# Altium schematic sheet 12-UART_CAN.SchDoc
size C
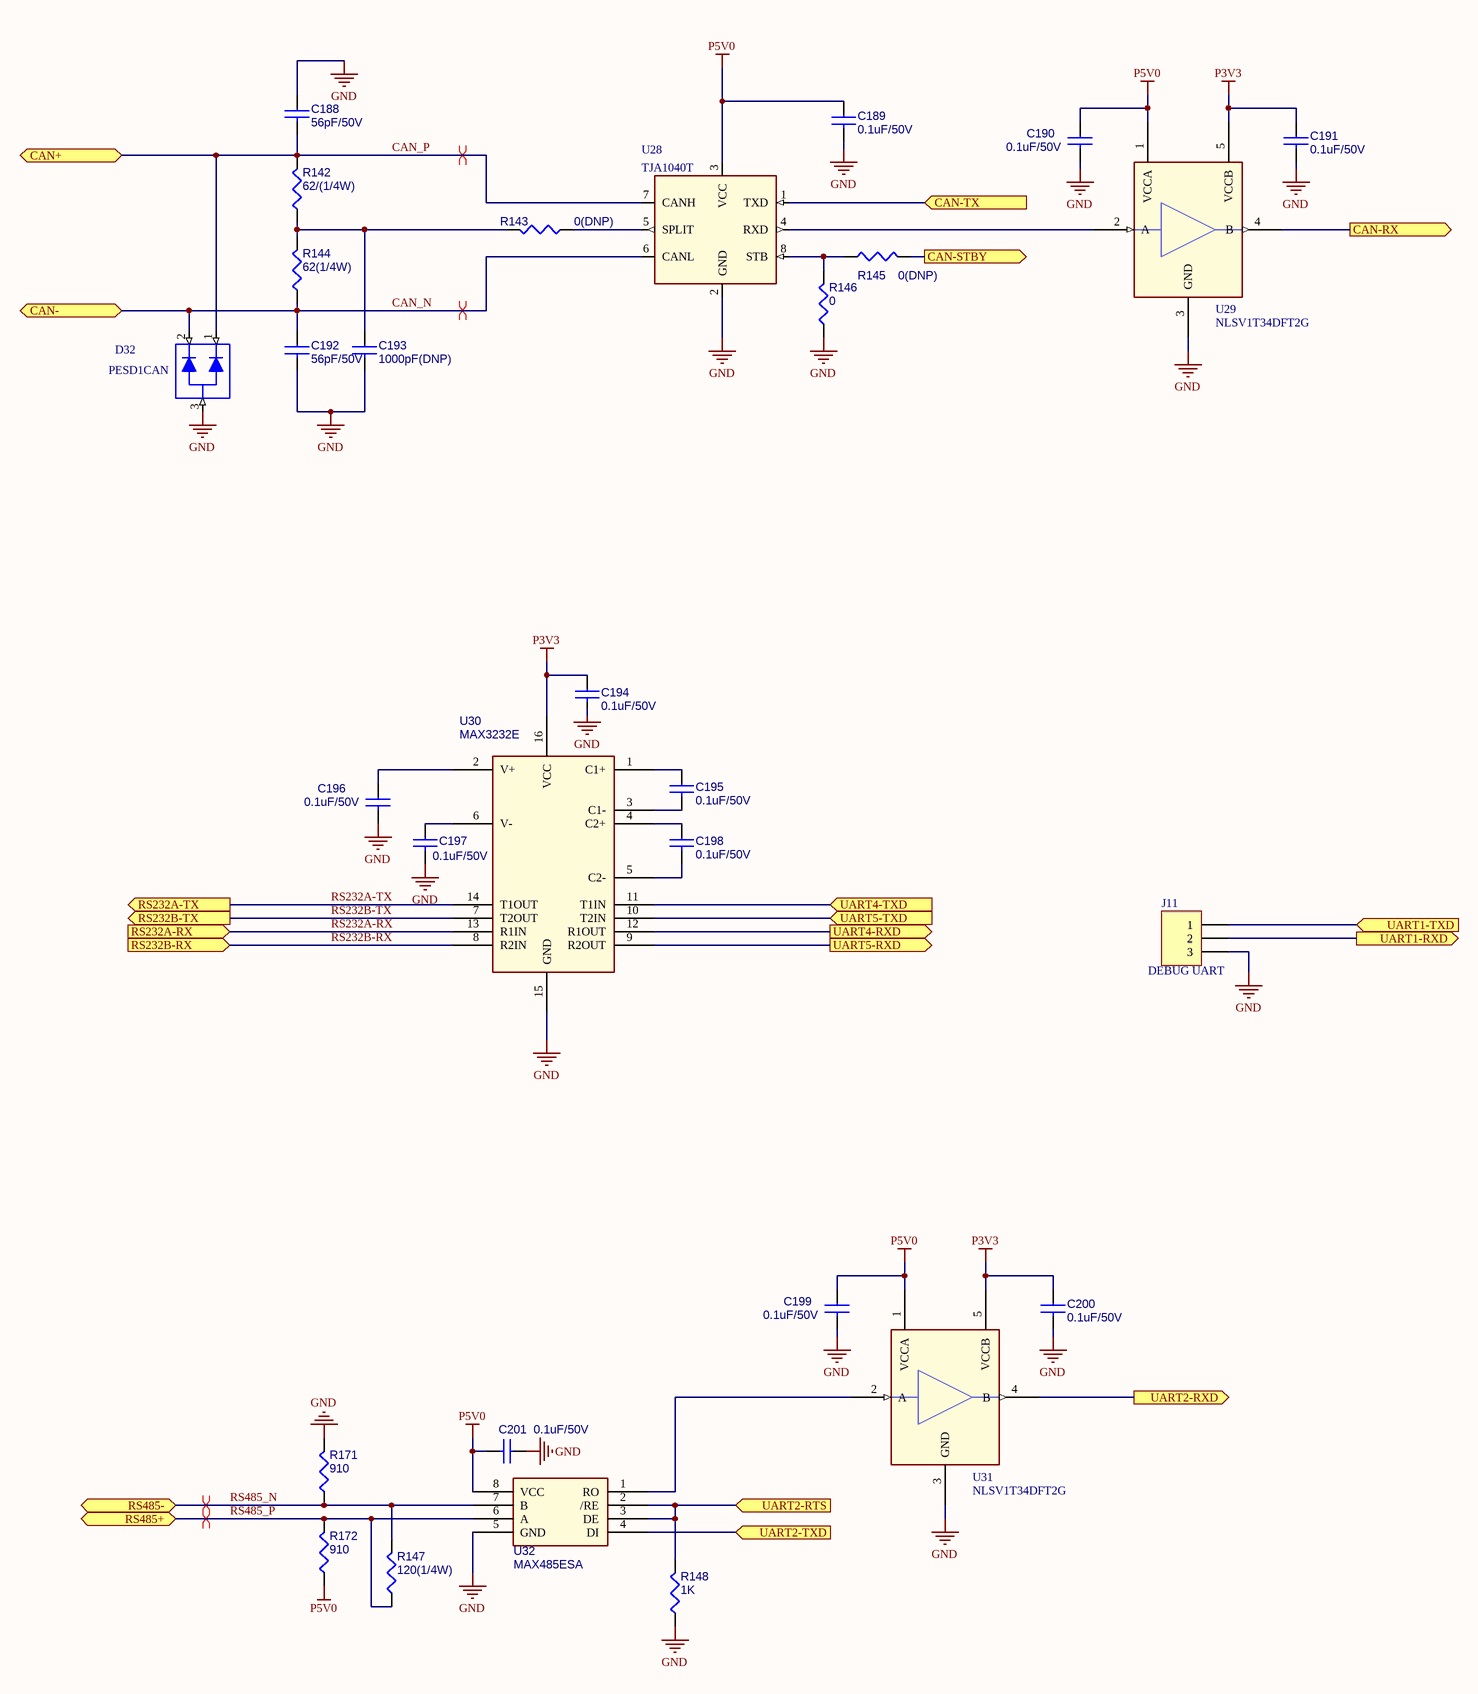
[diagram p0: 12-UART_CAN.SchDoc]

## Parts
C188  56pF/50V  [0402]
C189  0.1uF/50V  [0402]
C190  0.1uF/50V  [0402]
C191  0.1uF/50V  [0402]
C192  56pF/50V  [0402]
C193  1000pF(DNP)  [0402]
C194  0.1uF/50V  [0402]
C195  0.1uF/50V  [0402]
C196  0.1uF/50V  [0402]
C197  0.1uF/50V  [0402]
C198  0.1uF/50V  [0402]
C199  0.1uF/50V  [0402]
C200  0.1uF/50V  [0402]
C201  0.1uF/50V  [0402]
D32  PESD1CAN  [PESD2CAN]
J11  DEBUG UART  [HDR1X3]
R142  62/(1/4W)  [1206]
R143  0(DNP)  [0402]
R144  62(1/4W)  [1206]
R145  0(DNP)  [0402]
R146  0  [0402]
R147  120(1/4W)  [1206]
R148  1K  [0402]
R171  910  [0402]
R172  910  [0402]
U28  TJA1040T  [SO8]
U29  NLSV1T34DFT2G  [SC70]
U30  MAX3232E  [SO-16]
U31  NLSV1T34DFT2G  [SC70]
U32  MAX485ESA  [SO8]

## Ports
CAN+ (bidir), CAN- (bidir), CAN-RX (out), CAN-STBY (out), CAN-TX (in), RS232A-RX (in), RS232A-TX (out), RS232B-RX (in), RS232B-TX (out), RS485+ (bidir), RS485- (bidir), UART1-RXD (out), UART1-TXD (in), UART2-RTS (in), UART2-RXD (out), UART2-TXD (in), UART4-RXD (out), UART4-TXD (in), UART5-RXD (out), UART5-TXD (in)

## Nets
GND: C188.1 C189.2 C190.2 C191.2 C192.2 C193.2 C194.2 C196.2 C197.2 C199.2 C200.2 C201.1 D32.3 J11.3 R146.2 R148.2 R171.1 U28.2(GND) U29.3(GND) U30.15(GND) U31.3(GND) U32.5(GND)
P3V3: C191.1 C194.1 C200.1 U29.5(VCCB) U30.16(VCC) U31.5(VCCB)
P5V0: C189.1 C190.1 C199.1 C201.2 R172.2 U28.3(VCC) U29.1(VCCA) U31.1(VCCA) U32.8(VCC)
CAN-RX: U29.4(B) ; port CAN-RX
CAN-STBY: R145.1 ; port CAN-STBY
CAN-TX: U28.1(TXD) ; port CAN-TX
CAN_N: C192.1 D32.2 R144.2 U28.6(CANL) ; port CAN-
CAN_P: C188.2 D32.1 R142.1 U28.7(CANH) ; port CAN+
RS232A-RX: U30.13(R1IN) ; port RS232A-RX
RS232A-TX: U30.14(T1OUT) ; port RS232A-TX
RS232B-RX: U30.8(R2IN) ; port RS232B-RX
RS232B-TX: U30.7(T2OUT) ; port RS232B-TX
RS485_N: R147.1 R171.2 U32.7(B) ; port RS485-
RS485_P: R147.2 R172.1 U32.6(A) ; port RS485+
UART1-RXD: J11.2 ; port UART1-RXD
UART1-TXD: J11.1 ; port UART1-TXD
UART2-RTS: R148.1 U32.2(/RE) U32.3(DE) ; port UART2-RTS
UART2-RXD: U31.4(B) ; port UART2-RXD
UART2-TXD: U32.4(DI) ; port UART2-TXD
UART4-RXD: U30.12(R1OUT) ; port UART4-RXD
UART4-TXD: U30.11(T1IN) ; port UART4-TXD
UART5-RXD: U30.9(R2OUT) ; port UART5-RXD
UART5-TXD: U30.10(T2IN) ; port UART5-TXD
NetC193_1: C193.1 R142.2 R143.1 R144.1
NetC195_1: C195.1 U30.1(C1+)
NetC195_2: C195.2 U30.3(C1-)
NetC196_1: C196.1 U30.2(V+)
NetC197_1: C197.1 U30.6(V-)
NetC198_1: C198.1 U30.4(C2+)
NetC198_2: C198.2 U30.5(C2-)
NetR143_2: R143.2 U28.5(SPLIT)
NetR145_2: R145.2 R146.1 U28.8(STB)
NetU28_4: U28.4(RXD) U29.2(A)
NetU31_2: U31.2(A) U32.1(RO)

## Layout directives
differential pair: CAN_N, CAN_P, RS485_N, RS485_P

## Library data of the parts
C188-C193 C199 C200 = P_CAP NP
C194-C198 = CAP
C201 = P_CAP NP: Part Number: SE132225K8L; Part Description: S CER CAP 2.2U 10V K X5R 0603; Function Field: 41.5; Ecology: YES; ROOM: GPS; AP: AP; Part Type: CAPACITOR; Approved Date: 6/27/2006; Lead Free: MY
D32 = PESD2CAN: Part Number: SCA00000J00
J11 = Header 3: Header, 3-Pin; LatestRevisionDate: 17-Jul-2002; LatestRevisionNote: Re-released for DXP Platform.; Publisher: Altium Limited
R142-R146 = P_R
R147 R148 R171 R172 = R: Manufacturer Part number: null; Part Description: S RES 1/16W 10K +-5% 0402; Part Number: SD02810028L; ROOM: SD; Deletion Flag: 0; Function Field: 32.3; Ecology: YES; Part Type: RESISTOR; AP Sheet: http://ISPDPRD/Windchill/servlet/WindchillAuthGW/wt.enterprise.URLProcessor/URLTemplateAction?u8&oid=VR%3Aext.compal.part.Comp; AP: AP; Lead Free: Y1
U28 = TJA1040T_SO_8P: IC XCVR CAN HS 5V SO8; CAD_APPROVED: Yes; MFG_NAME01: NXP SEMICONDUCTORS; AGILE_PN: 312-79676; CLASS: IC; HEIGHT: 1.75 MM; ROHS: Yes; MFG_PN01: TJA1040T
U30 = MAX3232
U32 = MAX485